# EAGLE design BCD Clock (EAGLE 4.16)
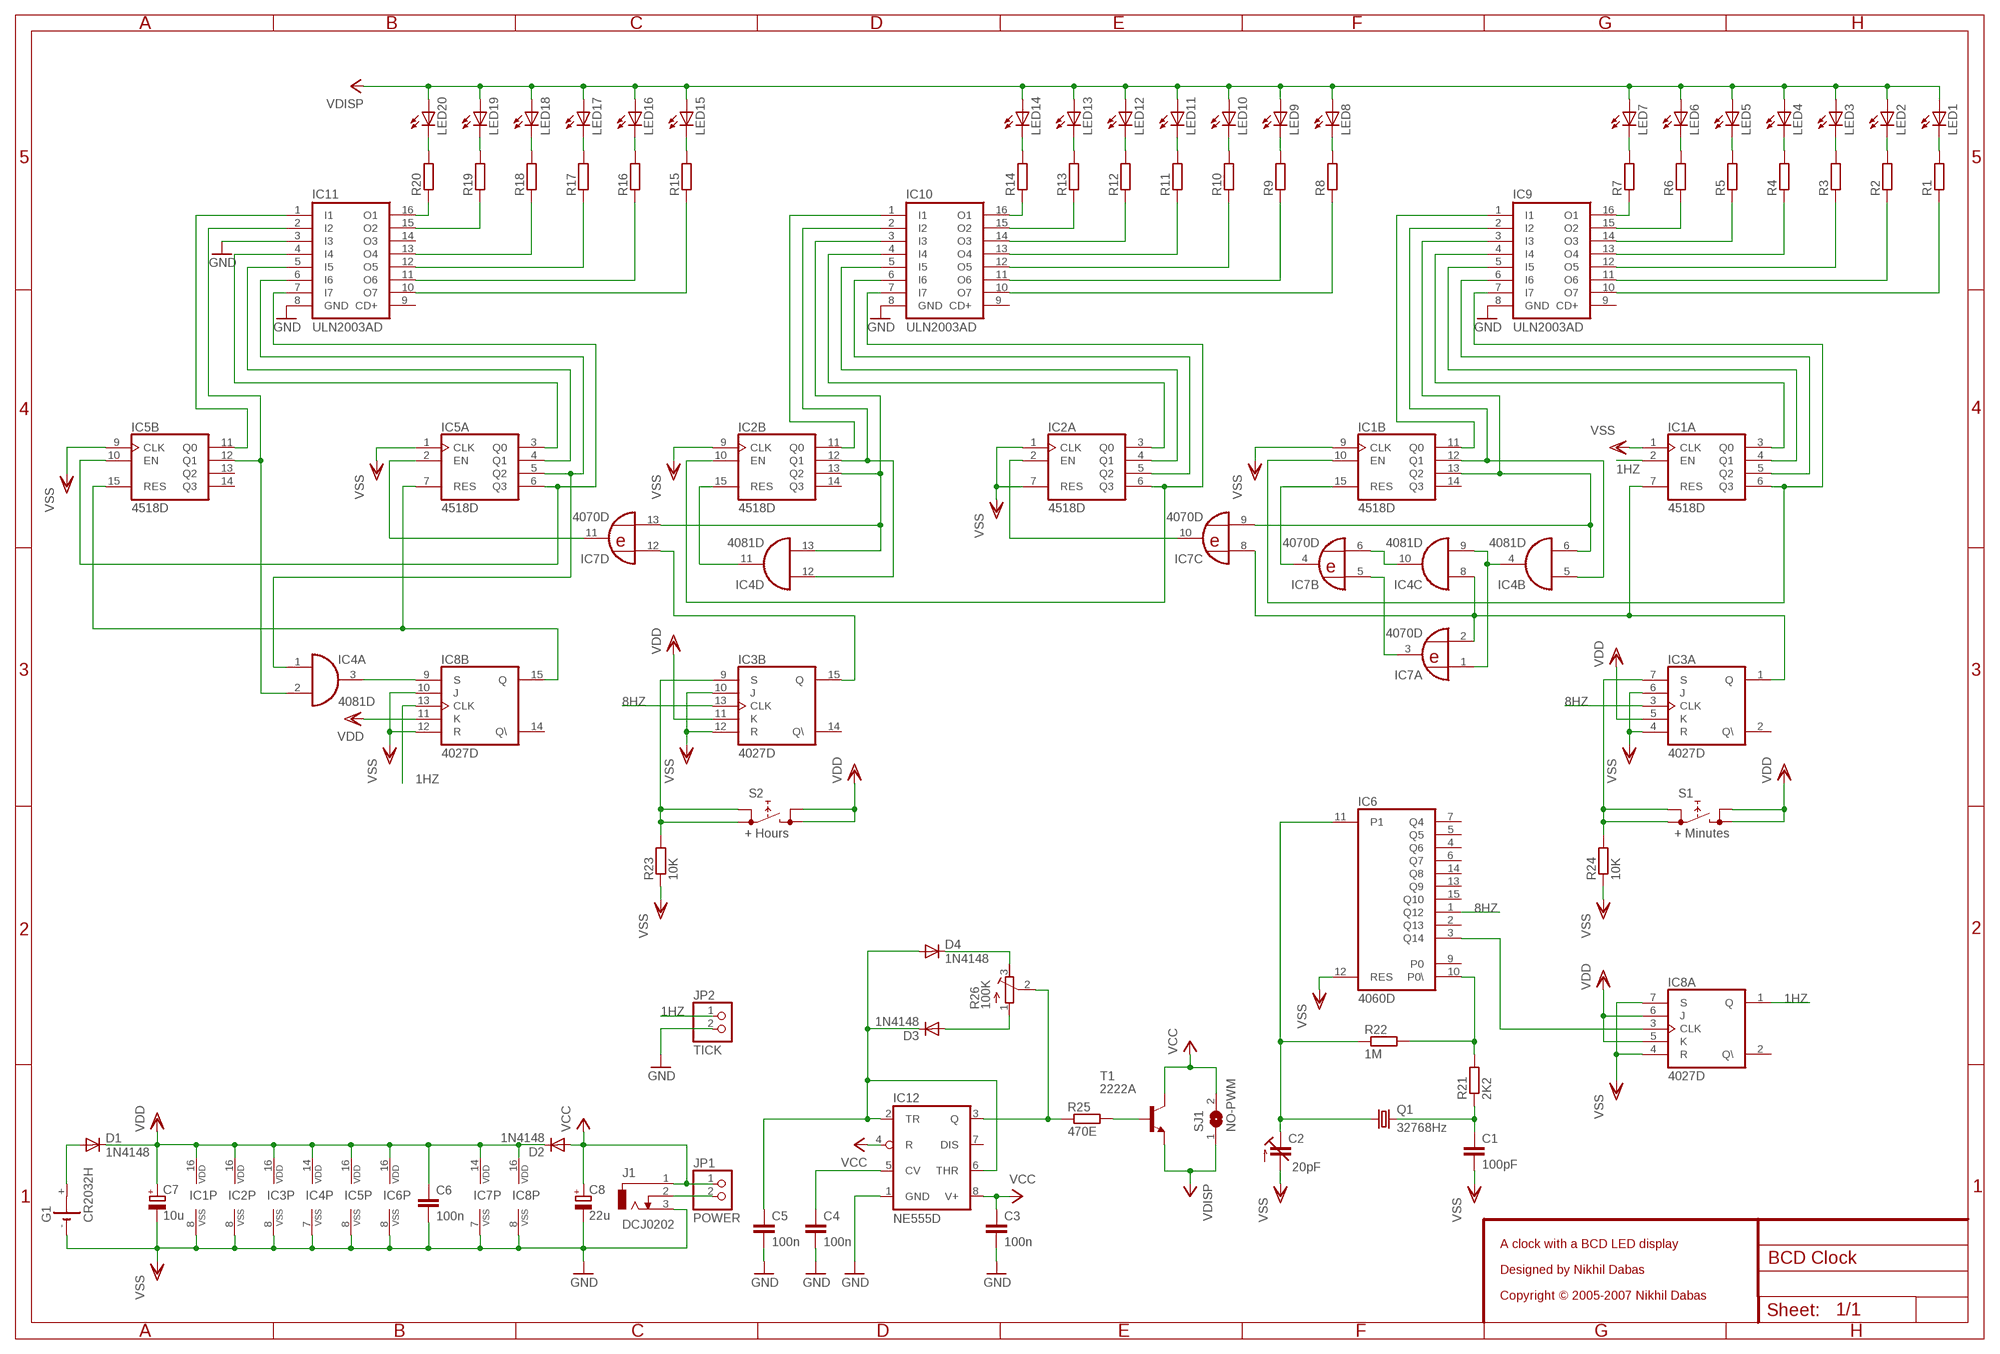
[diagram p0: schematic, sheet 1]

## Parts
C1  100pF  C-EUC1206  [C1206]
C2  20pF  C-TRIMMTZBX4  [CTRIMTZBX4]
C3  100n  C-EUC1206  [C1206]
C4  100n  C-EUC1206  [C1206]
C5  100n  C-EUC1206  [C1206]
C6  100n  C-EUC1206  [C1206]
C7  10u  CPOL-EUE2-5  [E2-5]
C8  22u  CPOL-EUE2-5  [E2-5]
D1  1N4148  DIODE-SOD80C  [SOD80C]
D2  1N4148  DIODE-SOD80C  [SOD80C]
D3  1N4148  DIODE-SOD80C  [SOD80C]
D4  1N4148  DIODE-SOD80C  [SOD80C]
G1  CR2032H  [CR2032H]
IC1  4518D  [SO16]
IC2  4518D  [SO16]
IC3  4027D  [SO16]
IC4  4081D  [SO14]
IC5  4518D  [SO16]
IC6  4060D  [SO16]
IC7  4070D  [SO14]
IC8  4027D  [SO16]
IC9  ULN2003AD  [SO16]
IC10  ULN2003AD  [SO16]
IC11  ULN2003AD  [SO16]
IC12  NE555D  [SO08]
J1  DCJ0202  [DCJ0202]
JP1  POWER  PINHD-1X2  [1X02]
JP2  TICK  PINHD-1X2  [1X02]
LED1  LEDCHIPLED_1206  [CHIPLED_1206]
LED2  LEDCHIPLED_1206  [CHIPLED_1206]
LED3  LEDCHIPLED_1206  [CHIPLED_1206]
LED4  LEDCHIPLED_1206  [CHIPLED_1206]
LED5  LEDCHIPLED_1206  [CHIPLED_1206]
LED6  LEDCHIPLED_1206  [CHIPLED_1206]
LED7  LEDCHIPLED_1206  [CHIPLED_1206]
LED8  LEDCHIPLED_1206  [CHIPLED_1206]
LED9  LEDCHIPLED_1206  [CHIPLED_1206]
LED10  LEDCHIPLED_1206  [CHIPLED_1206]
LED11  LEDCHIPLED_1206  [CHIPLED_1206]
LED12  LEDCHIPLED_1206  [CHIPLED_1206]
LED13  LEDCHIPLED_1206  [CHIPLED_1206]
LED14  LEDCHIPLED_1206  [CHIPLED_1206]
LED15  LEDCHIPLED_1206  [CHIPLED_1206]
LED16  LEDCHIPLED_1206  [CHIPLED_1206]
LED17  LEDCHIPLED_1206  [CHIPLED_1206]
LED18  LEDCHIPLED_1206  [CHIPLED_1206]
LED19  LEDCHIPLED_1206  [CHIPLED_1206]
LED20  LEDCHIPLED_1206  [CHIPLED_1206]
Q1  32768Hz  CRYTALTC26H  [TC26H]
R1  R-EU_R0805  [R0805]
R2  R-EU_R0805  [R0805]
R3  R-EU_R0805  [R0805]
R4  R-EU_R0805  [R0805]
R5  R-EU_R0805  [R0805]
R6  R-EU_R0805  [R0805]
R7  R-EU_R0805  [R0805]
R8  R-EU_R0805  [R0805]
R9  R-EU_R0805  [R0805]
R10  R-EU_R0805  [R0805]
R11  R-EU_R0805  [R0805]
R12  R-EU_R0805  [R0805]
R13  R-EU_R0805  [R0805]
R14  R-EU_R0805  [R0805]
R15  R-EU_R0805  [R0805]
R16  R-EU_R0805  [R0805]
R17  R-EU_R0805  [R0805]
R18  R-EU_R0805  [R0805]
R19  R-EU_R0805  [R0805]
R20  R-EU_R0805  [R0805]
R21  2K2  R-EU_R0805  [R0805]
R22  1M  R-EU_R0805  [R0805]
R23  10K  R-EU_R0805  [R0805]
R24  10K  R-EU_R0805  [R0805]
R25  470E  R-EU_R0805  [R0805]
R26  100K  R-TRIMM3103  [RTRIM3103]
S1  + Minutes  REKN  [REKN]
S2  + Hours  REKN  [REKN]
SJ1  NO-PWM  SJW  [SJW]
T1  2222A  MMBT2222ALT1-NPN-SOT23-BEC  [SOT23-BEC]

## Nets
1HZ: IC1.2(A:EN) IC8.1(A:Q) IC8.13(B:CLK) JP2.1
8HZ: IC3.3(A:CLK) IC3.13(B:CLK) IC6.1(Q12)
N$1: IC1.3(A:Q0) IC9.4(I4)
N$2: IC1.4(A:Q1) IC9.5(I5)
N$3: IC2.6(A:Q3) IC2.10(B:EN) IC10.7(I7)
N$4: IC1.6(A:Q3) IC1.10(B:EN) IC9.7(I7)
N$5: IC1.11(B:Q0) IC9.1(I1)
N$6: IC1.5(A:Q2) IC9.6(I6)
N$7: IC2.12(B:Q1) IC4.12(D:I0) IC10.2(I2)
N$8: IC2.5(A:Q2) IC10.6(I6)
N$9: IC3.7(A:S) R24.2 S1.0A S1.0B
N$10: IC5.2(A:EN) IC7.11(D:O)
N$11: IC2.4(A:Q1) IC10.5(I5)
N$12: IC2.3(A:Q0) IC10.4(I4)
N$13: IC1.12(B:Q1) IC4.5(B:I0) IC9.2(I2)
N$14: IC4.4(B:O) IC4.9(C:I1) IC7.1(A:I0)
N$15: IC2.11(B:Q0) IC10.1(I1)
N$16: IC5.4(A:Q1) IC11.5(I5)
N$17: IC5.3(A:Q0) IC11.4(I4)
N$18: LED11.C R11.2
N$19: IC11.10(O7) R15.1
N$20: IC11.11(O6) R16.1
N$21: IC11.12(O5) R17.1
N$22: IC11.13(O4) R18.1
N$23: IC11.16(O1) R20.1
N$24: IC11.15(O2) R19.1
N$25: IC10.16(O1) R14.1
N$26: IC10.15(O2) R13.1
N$27: IC10.13(O4) R11.1
N$28: IC10.14(O3) R12.1
N$29: IC10.12(O5) R10.1
N$30: IC10.11(O6) R9.1
N$31: IC1.7(A:RES) IC3.1(A:Q) IC4.8(C:I0) IC7.2(A:I1) IC7.8(C:I0)
N$32: IC1.15(B:RES) IC7.4(B:O)
N$33: IC4.10(C:O) IC7.6(B:I1)
N$34: IC7.3(A:O) IC7.5(B:I0)
N$35: IC2.15(B:RES) IC4.11(D:O)
N$36: IC3.9(B:S) R23.2 S2.0A S2.0B
N$38: IC10.10(O7) R8.1
N$39: LED20.C R20.2
N$40: IC5.11(B:Q0) IC11.1(I1)
N$41: IC5.6(A:Q3) IC5.10(B:EN) IC11.7(I7)
N$43: IC4.2(A:I1) IC5.12(B:Q1) IC11.2(I2)
N$44: LED19.C R19.2
N$45: IC4.3(A:O) IC8.9(B:S)
N$46: LED18.C R18.2
N$47: LED17.C R17.2
N$48: LED16.C R16.2
N$49: LED15.C R15.2
N$50: LED14.C R14.2
N$51: C1.1 Q1.2 R21.1
N$52: IC6.10(P0\) R21.2 R22.2
N$53: IC6.3(Q14) IC8.3(A:CLK)
N$54: C2.1(E) IC6.11(P1) Q1.1 R22.1
N$55: IC1.13(B:Q2) IC4.6(B:I1) IC7.9(C:I1) IC9.3(I3)
N$57: IC5.7(A:RES) IC5.15(B:RES) IC8.15(B:Q)
N$58 [Power]: J1.2 JP1.2
N$59: LED13.C R13.2
N$60: IC4.1(A:I0) IC5.5(A:Q2) IC11.6(I6)
N$62: LED12.C R12.2
N$63: LED10.C R10.2
N$64: LED9.C R9.2
N$65: LED8.C R8.2
N$66: IC9.16(O1) R7.1
N$67: IC9.15(O2) R6.1
N$68: IC9.14(O3) R5.1
N$69: IC9.13(O4) R4.1
N$70: IC9.12(O5) R3.1
N$71: IC9.11(O6) R2.1
N$72: IC9.10(O7) R1.1
N$73: LED7.C R7.2
N$74: LED6.C R6.2
N$75: LED5.C R5.2
N$76: LED4.C R4.2
N$77: LED3.C R3.2
N$78: LED2.C R2.2
N$79: LED1.C R1.2
N$80: D1.A G1.+
N$81: C4.1 IC12.5(CV)
N$82: C5.1 D3.C D4.A IC12.2(TR) IC12.6(THR)
N$83: IC12.3(Q) R25.1 R26.2(S)
N$84: R25.2 T1.B
N$85: D4.C R26.3(A)
N$86: D3.A R26.1(E)
N$87: IC2.2(A:EN) IC7.10(C:O)
N$88: IC2.13(B:Q2) IC4.13(D:I1) IC7.13(D:I1) IC10.3(I3)
N$89: IC3.15(B:Q) IC7.12(D:I0)
VCC [Power]: C3.1 C8.+ D2.A IC12.4(R) IC12.8(V+) J1.1 JP1.1 SJ1.2 T1.C
VDD [Power]: C6.1 C7.+ D1.C D2.C IC1.16(P:VDD) IC2.16(P:VDD) IC3.5(A:K) IC3.11(B:K) IC3.16(P:VDD) IC4.14(P:VDD) IC5.16(P:VDD) IC6.16(VDD) IC7.14(P:VDD) IC8.5(A:K) IC8.6(A:J) IC8.11(B:K) IC8.16(P:VDD) S1.1A S1.1B S2.1A S2.1B
VDISP [Power]: LED1.A LED2.A LED3.A LED4.A LED5.A LED6.A LED7.A LED8.A LED9.A LED10.A LED11.A LED12.A LED13.A LED14.A LED15.A LED16.A LED17.A LED18.A LED19.A LED20.A SJ1.1 T1.E
VSS [Power]: C1.2 C2.2(A) C3.2 C4.2 C5.2 C6.2 C7.- C8.- G1.- IC1.1(A:CLK) IC1.8(P:VSS) IC1.9(B:CLK) IC2.1(A:CLK) IC2.7(A:RES) IC2.8(P:VSS) IC2.9(B:CLK) IC3.4(A:R) IC3.6(A:J) IC3.8(P:VSS) IC3.10(B:J) IC3.12(B:R) IC4.7(P:VSS) IC5.1(A:CLK) IC5.8(P:VSS) IC5.9(B:CLK) IC6.8(VSS) IC6.12(RES) IC7.7(P:VSS) IC8.4(A:R) IC8.7(A:S) IC8.8(P:VSS) IC8.10(B:J) IC8.12(B:R) IC9.8(GND) IC10.8(GND) IC11.3(I3) IC11.8(GND) IC12.1(GND) J1.3 JP2.2 R23.1 R24.1 ; supply symbol labelled GND
Unconnected: G1.+@1(+) IC1.14(B:Q3) IC2.14(B:Q3) IC3.2(A:Q\) IC3.14(B:Q\) IC5.13(B:Q2) IC5.14(B:Q3) IC6.2(Q13) IC6.4(Q6) IC6.5(Q5) IC6.6(Q7) IC6.7(Q4) IC6.9(P0) IC6.13(Q9) IC6.14(Q8) IC6.15(Q10) IC8.2(A:Q\) IC8.14(B:Q\) IC9.9(CD+) IC10.9(CD+) IC11.9(CD+) IC11.14(O3) IC12.7(DIS)

## Notes on the sheet
- A clock with a BCD LED display
- Designed by Nikhil Dabas
- Copyright © 2005-2007 Nikhil Dabas

## Library data of the parts
C1 C3-C6 = rcl:C-EU: CAPACITOR, European symbol
C2 = rcl:C-TRIMM: Trimm capacitor
C7 C8 = rcl:CPOL-EU: POLARIZED CAPACITOR, European symbol
D1-D4 = diode:DIODE-: DIODE
G1 = battery:CR2032H: LI BATTERY Varta
IC1 IC2 IC5 = 45xx:4518: Dual BCD up COUNTER
IC3 IC8 = 40xx:4027: Dual JK FLIP FLOP
IC4 = 40xx:4081: Quad 2-input AND
IC6 = 40xx:4060: 14-stage binary/ripple COUNTER
IC7 = 40xx:4070: Quad 2-input XOR
IC9-IC11 = uln-udn:ULN2003A: DRIVER ARRAY
IC12 = linear:*555: TIMER
J1 = con-jack:DCJ0202: DC POWER JACK Source: DCJ0202.pdf
JP1 JP2 = pinhead:PINHD-1X2: PIN HEADER
LED1-LED20 = led:LED: LED OSRAM: - CHIPLED LG R971, LG N971, LY N971, LG Q971, LY Q971, LO R971, LY R971 LH N974, LH R974 LS Q976, LO Q976, LY Q976 LO Q996 - Hyper CHIPLED LW Q18S LB Q993, LB Q99A, LB R99A - SideLED LS A670, LO A670, LY A670, LG A670, LP A670 LB A673, LV A673, LT A673, LW A673 LH A674 LY A675 LS A676, LA A676, LO A676, LY A676, LW A676 LS A679, LY A679, LG A679 - Hyper Micro SIDELED® LS Y876, LA Y876, LO Y876, LY Y876 LT Y87S - SmartLED LW L88C, LW L88S LB L89C, LB L89S, LG L890 LS L89K, LO L89K, LY L89K LS L896, LA L896, LO L896, LY L896 - TOPLED LS T670, LO T670, LY T670, LG T670, LP T670 LSG T670, LSP T670, LSY T670, LOP T670, LYG T670 LG T671, LOG T671, LSG T671 LB T673, LV T673, LT T673, LW T673 LH T674 LS T676, LA T676, LO T676, LY T676, LB T676, LH T676, LSB T676, LW T676 LB T67C, LV T67C, LT T67C, LS T67K, LO T67K, LY T67K, LW E67C LS E67B, LA E67B, LO E67B, LY E67B, LB E67C, LV E67C, LT E67C LW T67C LS T679, LY T679, LG T679 LS T770, LO T770, LY T770, LG T770, LP T770 LB T773, LV T773, LT T773, LW T773 LH T774 LS E675, LA E675, LY E675, LS T675 LS T776, LA T776, LO T776, LY T776, LB T776 LHGB T686 LT T68C, LB T68C - Hyper Mini TOPLED® LB M676 - Mini TOPLED Santana® LG M470 LS M47K, LO M47K, LY M47K Source: http://www.osram.convergy.de/
Q1 = crystal:CRYTAL: CRYSTAL
R1-R25 = rcl:R-EU_: RESISTOR, European symbol
R26 = rcl:R-TRIMM: Trimm resistor
S1 S2 = switch:REKN: PUSH SWITCH ITT-Cannon-Cannon
SJ1 = jumper:SJ: SMD solder JUMPER
T1 = transistor:*-NPN-: NPN Transistror

## Net classes
0 default: width 0.305 mm, drill 0.203 mm
1 Power: width 0.61 mm, drill 0.406 mm

## Board
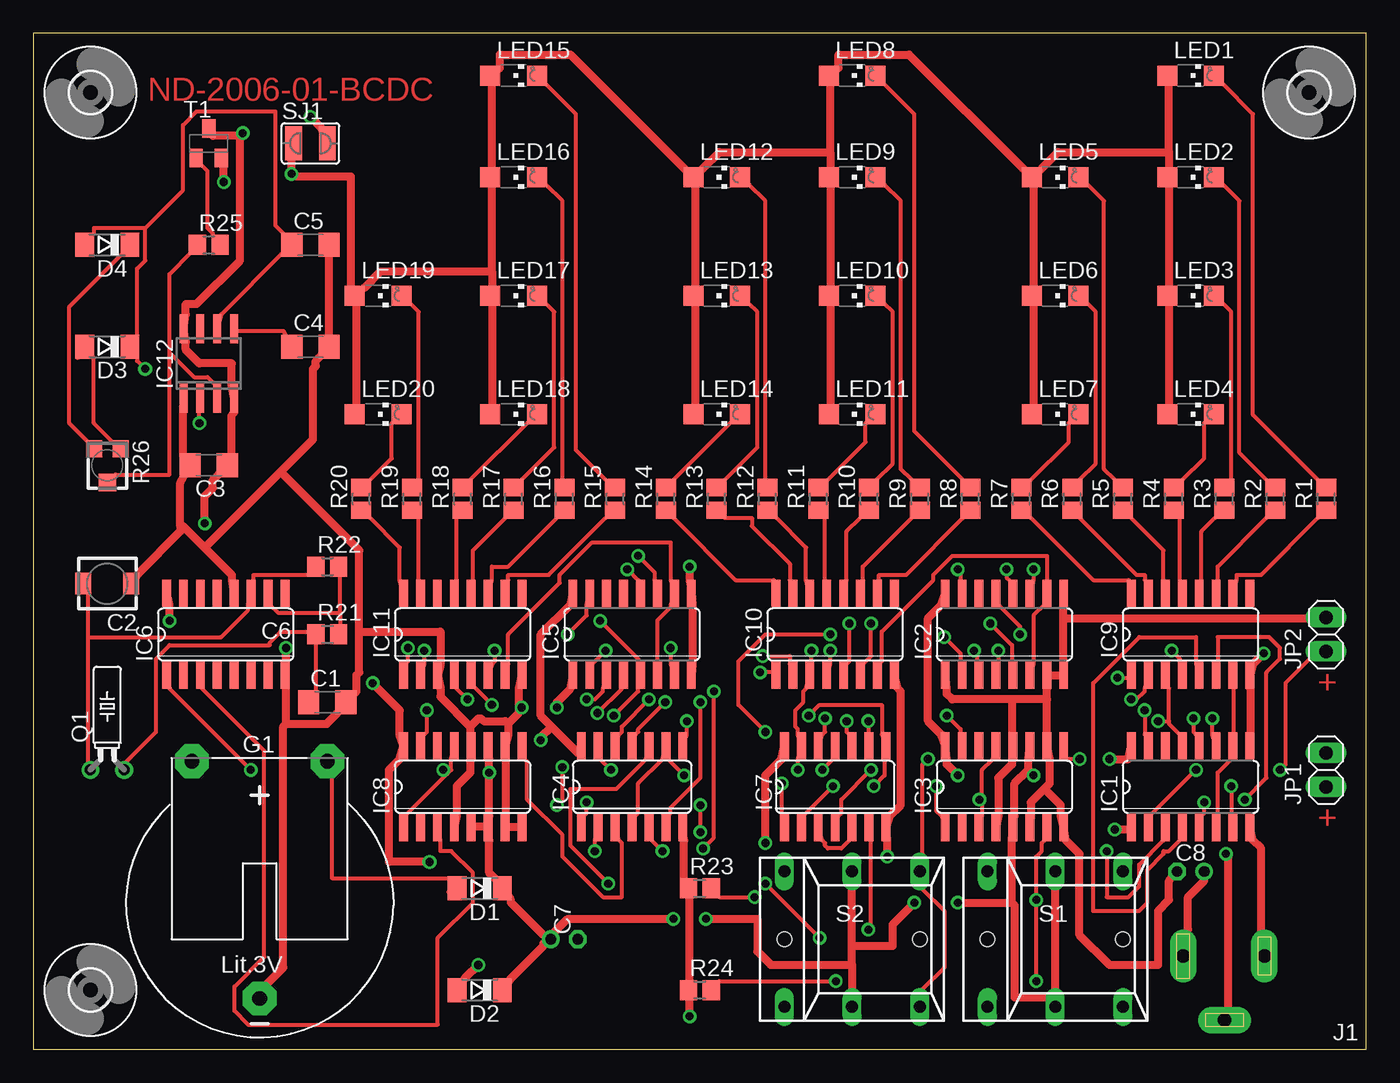
[diagram p1: board, top side]
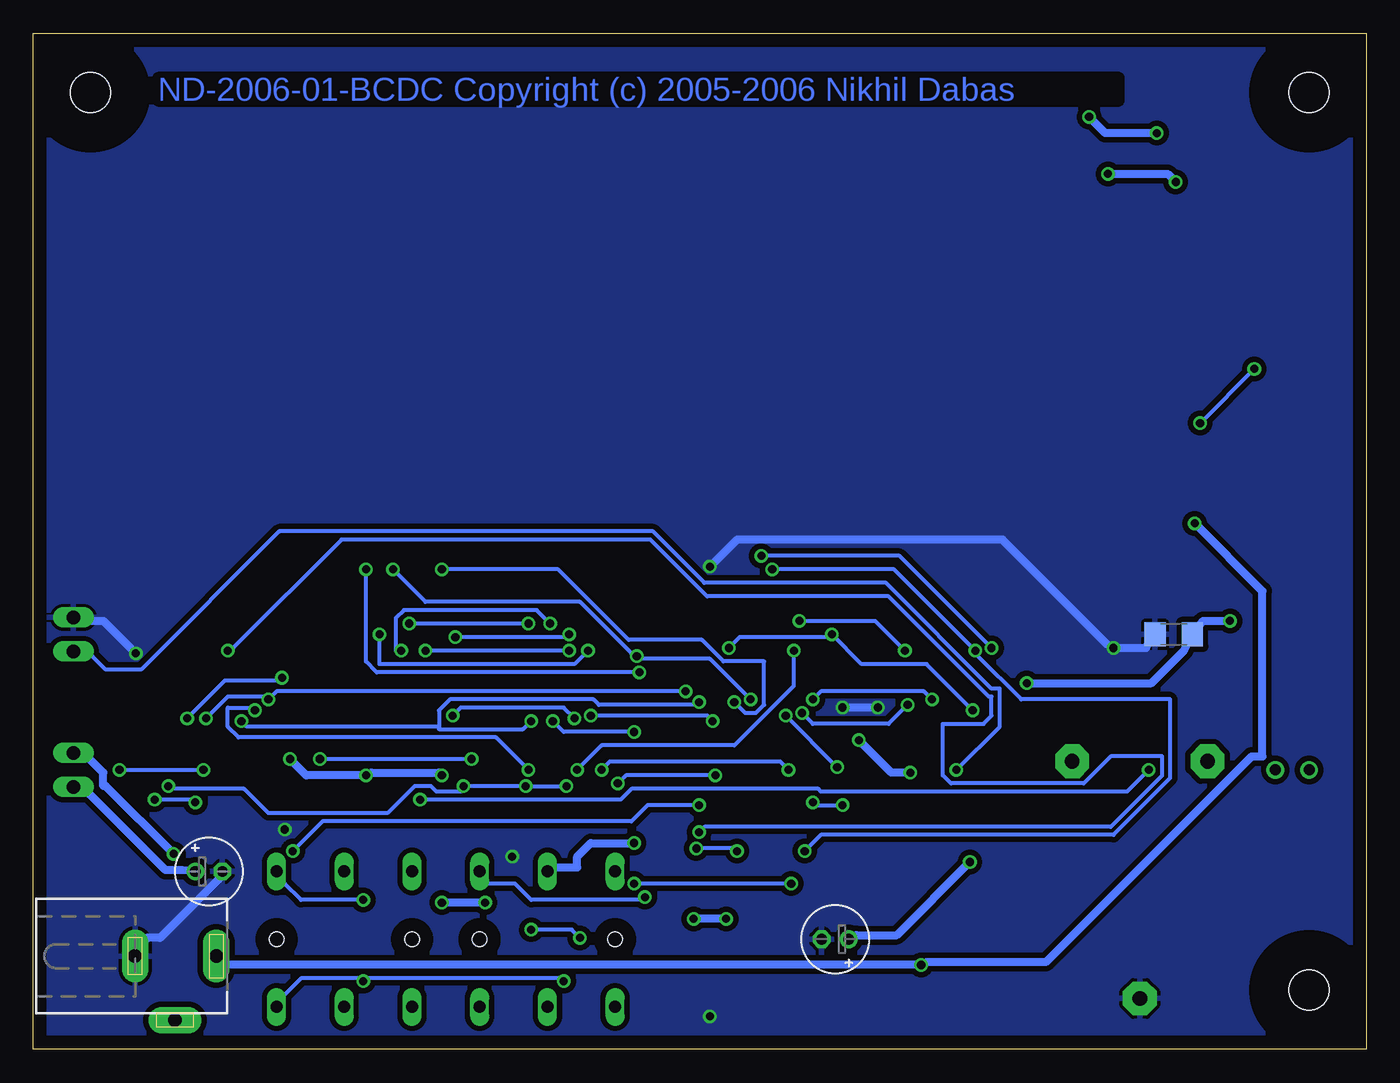
[diagram p2: board, bottom side, seen from below]

Size 100 x 76.19 mm. Coordinates in mm from the lower left corner, seen from the top.
Outline: 0,0 100,0 100,76.19 0,76.19 0,0
Copper layers (1*16): Top 0.035mm / dielectric 1.5mm / Bottom 0.035mm
Design rules "default": minimum track width 10mil, minimum drill 24mil, track to track 8mil, track to pad 8mil, pad to pad 8mil, via to via 8mil, smd to smd 8mil, copper to edge 40mil, drill to drill 8mil, minimum pad ring 10mil, minimum via ring 8mil, stop-mask expansion 4mil, vias tented up to drill 0mil, thermal gap 10mil

### Footprints (pad centres in the part's own frame; a part is rotated, then mirrored left to right if it is on the bottom)
C1206 = smd 1.6 x 1.8: 1 -1.4,0; 2 1.4,0
CTRIMTZBX4 = smd 1.6 x 1.2: 1 0,1.8; 2 0,-1.8
E2-5 = drill 0.813 pad 1.27 round: + -1.016,0 | drill 0.813 pad 1.27 octagon: - 1.016,0
SOD80C = smd 1.4 x 1.8: A 1.7,0; C -1.7,0
CR2032H = drill 1.118 pad 2.54 octagon: + 5.08,10.795; +@1 -5.08,10.795; - 0,-6.985
SO16 = smd 0.66 x 2.032: 1 -4.445,-3.073; 2 -3.175,-3.073; 3 -1.905,-3.073; 4 -0.635,-3.073; 5 0.635,-3.073; 6 1.905,-3.073; 7 3.175,-3.073; 8 4.445,-3.073; 9 4.445,3.073; 10 3.175,3.073; 11 1.905,3.073; 12 0.635,3.073; 13 -0.635,3.073; 14 -1.905,3.073; 15 -3.175,3.073; 16 -4.445,3.073
SO14 = smd 0.66 x 2.032: 1 -3.81,-3.073; 2 -2.54,-3.073; 3 -1.27,-3.073; 4 0,-3.073; 5 1.27,-3.073; 6 2.54,-3.073; 7 3.81,-3.073; 8 3.81,3.073; 9 2.54,3.073; 10 1.27,3.073; 11 0,3.073; 12 -1.27,3.073; 13 -2.54,3.073; 14 -3.81,3.073
SO08 = smd 0.6 x 2.2: 1 -1.905,-2.6; 2 -0.635,-2.6; 3 0.635,-2.6; 4 1.905,-2.6; 5 1.905,2.6; 6 0.635,2.6; 7 -0.635,2.6; 8 -1.905,2.6
DCJ0202 = drill 1 pad 2 long: 1 0,3.1; 2 4.8,0; 3 0,-3
1X02 = drill 1.016 long: 1 -1.27,0; 2 1.27,0
CHIPLED_1206 = smd 1.5 x 1.5: A 0,-1.75; C 0,1.75
TC26H = drill 0.813 round: 1 -1.27,0; 2 1.27,0
R0805 = smd 1.3 x 1.5: 1 -0.85,0; 2 0.85,0
RTRIM3103 = smd 1.2 x 1.25: 1 -1,-1.225; 3 1,-1.225 | smd 1.3 x 1.3: 2 0,1.3
REKN = drill 0.9 long: 0A 5.08,5.08; 0B 5.08,-5.08; 1A 0,5.08; 1B 0,-5.08; A -5.08,5.08; B -5.08,-5.08 | hole 1.1: -5.08,0; 5.08,0
SJW = smd 1.27 x 2.54: 1 -1.27,0; 2 1.27,0
SOT23-BEC = smd 1 x 1.4: B -0.95,-1.1; C 0,1.1; E 0.95,-1.1
3,0 = hole 3: 0,0

### Placement (x,y rotation side)
C1  22.06,26.03 0 top
C2  5.55,34.92 90 top
C3  13.17,43.81 180 top
C4  20.79,52.7 0 top
C5  20.79,60.32 0 top
C6  14.44,31.11 180 bottom
C7  39.84,8.25 180 bottom
C8  86.83,13.33 0 bottom
D1  33.49,12.06 180 top
D2  33.49,4.44 180 top
D3  5.55,52.7 180 top
D4  5.55,60.32 180 top
G1  16.98,10.79 0 top
IC1  86.83,19.68 0 top
IC2  72.86,31.11 0 top
IC3  72.86,19.68 0 top
IC4  44.92,19.68 0 top
IC5  44.92,31.11 0 top
IC6  14.44,31.11 0 top
IC7  60.16,19.68 0 top
IC8  32.22,19.68 0 top
IC9  86.83,31.11 0 top
IC10  60.16,31.11 0 top
IC11  32.22,31.11 0 top
IC12  13.17,51.43 0 top
J1  89.37,6.98 270 bottom
JP1  96.99,20.95 90 top
JP2  96.99,31.11 90 top
LED1  86.83,73.02 270 top
LED2  86.83,65.4 270 top
LED3  86.83,56.51 270 top
LED4  86.83,47.62 270 top
LED5  76.67,65.4 270 top
LED6  76.67,56.51 270 top
LED7  76.67,47.62 270 top
LED8  61.43,73.02 270 top
LED9  61.43,65.4 270 top
LED10  61.43,56.51 270 top
LED11  61.43,47.62 270 top
LED12  51.27,65.4 270 top
LED13  51.27,56.51 270 top
LED14  51.27,47.62 270 top
LED15  36.03,73.02 270 top
LED16  36.03,65.4 270 top
LED17  36.03,56.51 270 top
LED18  36.03,47.62 270 top
LED19  25.87,56.51 270 top
LED20  25.87,47.62 270 top
Q1  5.55,20.95 0 top
R1  96.99,41.27 90 top
R2  93.18,41.27 90 top
R3  89.37,41.27 90 top
R4  85.56,41.27 90 top
R5  81.75,41.27 90 top
R6  77.94,41.27 90 top
R7  74.13,41.27 90 top
R8  70.32,41.27 90 top
R9  66.51,41.27 90 top
R10  62.7,41.27 90 top
R11  58.89,41.27 90 top
R12  55.08,41.27 90 top
R13  51.27,41.27 90 top
R14  47.46,41.27 90 top
R15  43.65,41.27 90 top
R16  39.84,41.27 90 top
R17  36.03,41.27 90 top
R18  32.22,41.27 90 top
R19  28.41,41.27 90 top
R20  24.6,41.27 90 top
R21  22.06,31.11 0 top
R22  22.06,36.19 0 top
R23  50,12.06 0 top
R24  50,4.44 0 top
R25  13.17,60.32 0 top
R26  5.55,43.81 180 top
S1  76.67,8.25 0 top
S2  61.43,8.25 0 top
SJ1  20.79,67.94 0 top
T1  13.17,67.94 0 top
U$1  [3,0]  4.28,71.75 0 top
U$3  [3,0]  95.72,71.75 0 top
U$4  [3,0]  4.28,4.44 0 top

### Tracks (layer width: path | path; a pad name or v marks a point on that pad's centre or on a via)
1HZ  (via drill 0.61)
  Top 0.305: v87.24,20.95 83.78,17.5 IC1.2 | v93.54,20.95 93.94,21.36 93.94,27.45 95.77,29.28 JP2.1 | 31.05,20.65 31.36,20.95 31.36,21.76 IC8.13 | 31.05,20.65 27.9,17.5 IC8.1 | 31.05,20.65 v30.75,20.95
  Bottom 0.305: v93.54,20.95 v87.24,20.95 | v30.75,20.95 27.5,24.2 27.5,27.05 28.11,27.05 36.03,34.97 49.64,34.97 53.51,38.83 81.55,38.83 91.91,28.47 94.55,28.47 95.57,29.48 JP2.1
8HZ  (via drill 0.61)
  Top 0.305: 71.18,18.71 71.18,20.95 72,21.76 IC3.13 | 71.18,18.71 71.18,17.5 IC3.3 | v16.32,20.95 10.22,27.05 IC6.1 | v70.98,18.71 71.18,18.71
  Bottom 0.305: v16.32,20.95 17.95,19.32 40.91,19.32 41.11,19.53 55.13,19.53 55.94,18.71 v70.98,18.71
N$1  (via drill 0.61)
  Top 0.305: v80.53,14.85 80.53,11.4 82.16,11.4 82.97,12.21 82.97,13.84 84.8,15.67 IC1.3 | v50.05,16.28 v50.05,18.31 | v85.41,29.89 86.02,29.28 86.02,28.87 IC9.4
  Bottom 0.305: v80.53,14.85 78.3,17.09 55.13,17.09 53.91,18.31 v50.05,18.31 | v50.05,16.28 49.64,16.68 19.16,16.68 15.3,20.54 15.3,21.97 19.16,21.97 21.2,19.93 31.15,19.93 31.76,20.54 31.76,24.4 28.71,24.4 28.11,25.01 28.11,26.44 28.31,26.44 35.83,33.95 49.44,33.95 53.71,38.22 76.87,38.22 85,30.09 v85.41,29.89
N$2
  Top 0.305: IC1.4 86.02,15.67 85.2,14.85 84.8,14.85 84.8,14.65 83.58,13.43 83.58,10.99 82.97,10.38 79.51,10.38 79.51,27.45 82.97,30.91 87.24,30.91 87.24,28.87 IC9.5
N$3
  Top 0.305: IC10.7 63.46,28.87 63.67,29.08 63.67,31.31 67.53,35.17 67.53,35.58 68.95,37 76.06,37 76.06,35.17 IC2.10 75.86,33.35 75.04,32.53 75.04,28.87 IC2.6
N$4
  Top 0.305: IC1.6 88.86,17.5 88.86,20.75 89.88,21.76 IC1.10 90.08,23.59 90.08,27.05 IC9.7
N$5  (via drill 0.61)
  Top 0.305: v81.34,27.86 82.16,27.86 IC9.1 | v88.46,24.81 88.46,23.59 IC1.11
  Bottom 0.305: v81.34,27.86 81.55,27.66 85.61,27.66 v88.46,24.81
N$6  (via drill 0.61)
  Top 0.305: v87.85,18.51 87.85,17.7 87.64,17.5 IC1.5 | v90.89,18.71 92.52,20.34 92.52,28.27 93.54,29.28 93.54,30.09 92.72,30.91 88.86,30.91 88.86,28.87 IC9.6
  Bottom 0.305: v87.85,18.51 88.05,18.71 v90.89,18.71
N$7  (via drill 0.61)
  Top 0.305: v46.19,26.23 44.16,24.2 44.16,23.79 43.95,23.59 IC4.12 | v54.72,29.48 56.76,29.48 56.76,28.87 IC10.2 | v73.01,35.99 73.01,35.38 73.22,35.17 IC2.12
  Bottom 0.305: v46.19,26.23 49.24,29.28 54.52,29.28 v54.72,29.48 55.13,29.69 58.99,33.55 70.57,33.55 v73.01,35.99
N$8  (via drill 0.61)
  Top 0.305: v62.85,31.92 62.85,29.48 62.24,28.87 IC10.6 | v71.79,31.92 73.42,30.3 73.42,28.87 IC2.5
  Bottom 0.305: v62.85,31.92 v71.79,31.92
N$9  (via drill 0.61)
  Top 0.305: v60.21,5.1 51.47,5.1 R24.2 | v75.25,5.1 v75.25,11.2 75.25,14.45 75.65,14.85 75.65,15.46 75.86,15.67 IC3.7
  Bottom 0.305: v60.21,5.1 60.41,5.3 75.25,5.3 | 75.25,5.3 79.92,5.3 81.14,4.08 S1.0B | 75.25,5.3 v75.25,5.1 | v75.25,11.2 79.92,11.2 81.14,12.42 S1.0A
N$10  (via drill 0.61)
  Top 0.305: v59.19,20.95 60.01,21.76 IC7.11 | v42.94,29.89 41.92,28.87 IC5.2
  Bottom 0.305: v59.19,20.95 57.37,22.78 47.41,22.78 42.94,27.25 v42.94,29.89
N$11  (via drill 0.61)
  Top 0.305: v61.23,31.92 61.23,29.08 61.02,28.87 IC10.5 | v72.4,29.89 72.4,28.87 IC2.4
  Bottom 0.305: v61.23,31.92 62.24,32.94 72.2,32.94 72.81,32.33 72.81,29.89 v72.4,29.89
N$12  (via drill 0.61)
  Top 0.305: v59.8,29.89 59.8,28.87 IC10.4 | v70.57,29.89 70.78,29.69 70.78,28.87 IC2.3
  Bottom 0.305: v59.8,29.89 v70.57,29.89
N$13  (via drill 0.61)
  Top 0.305: v47.21,14.85 46.39,15.67 IC4.5 | v50.25,15.06 51.07,15.87 v51.07,26.84 | v82.36,26.23 82.77,26.23 83.38,26.84 83.38,27.05 IC9.2 | v87.03,24.81 87.03,23.79 87.24,23.59 IC1.12
  Bottom 0.305: v47.21,14.85 47.41,15.06 v50.25,15.06 | v51.07,26.84 81.75,26.84 v82.36,26.23 82.77,26.44 85.41,26.44 v87.03,24.81
N$14  (via drill 0.61)
  Top 0.305: IC4.4 45.17,17.5 45.38,17.7 45.38,19.93 47.21,21.76 IC4.9 47.61,21.76 v48.83,20.54 | v56.15,19.93 56.15,17.5 IC7.1
  Bottom 0.305: v56.15,19.93 55.54,20.54 v48.83,20.54
N$15  (via drill 0.61)
  Top 0.305: v54.52,28.27 55.54,28.27 IC10.1 | v75.04,35.99 75.04,35.17 IC2.11
  Bottom 0.305: v54.52,28.27 74.23,28.27 75.04,29.08 v75.04,35.99
N$16  (via drill 0.61)
  Top 0.305: v34.4,25.83 32.98,27.25 IC11.5 | v42.33,25.22 44.16,27.05 IC5.4
  Bottom 0.305: v34.4,25.83 35.83,24.4 41.52,24.4 v42.33,25.22
N$17  (via drill 0.61)
  Top 0.305: v32.58,26.23 31.76,27.05 IC11.4 | v41.52,26.23 42.13,26.23 42.74,26.84 42.74,27.05 IC5.3
  Bottom 0.305: v32.58,26.23 33.19,26.84 40.91,26.84 v41.52,26.23
N$18
  Top 0.305: R11.2 59.6,42.69 62.45,45.54 62.45,46.96 LED11.C
N$19
  Top 0.305: R15.1 42.94,39.85 38.67,35.58 35.62,35.58 35.62,35.17 IC11.10
N$20
  Top 0.305: R16.1 39.28,39.85 35.62,36.19 34.4,36.19 34.4,35.17 IC11.11
N$21
  Top 0.305: R17.1 35.42,39.85 32.98,37.41 32.98,35.17 IC11.12
N$22
  Top 0.305: R18.1 31.76,39.85 31.76,35.17 IC11.13
N$23
  Top 0.305: R20.1 25.26,39.85 27.5,37.61 27.5,35.17 IC11.16
N$24
  Top 0.305: R19.1 28.92,39.85 28.92,35.17 IC11.15
N$25
  Top 0.305: R14.1 48.02,39.85 52.69,35.17 55.54,35.17 IC10.16
N$26
  Top 0.305: R13.1 51.88,39.85 53.91,39.85 53.91,39.24 56.76,36.39 56.76,35.17 IC10.15
N$27
  Top 0.305: R11.1 59.4,39.85 59.4,35.17 IC10.13
N$28
  Top 0.305: R12.1 55.74,39.85 57.98,37.61 57.98,35.17 IC10.14
N$29
  Top 0.305: R10.1 62.04,39.85 61.02,38.83 61.02,35.17 IC10.12
N$30
  Top 0.305: R9.1 65.9,39.85 62.24,36.19 62.24,35.17 IC10.11
N$31  (via drill 0.61)
  Top 0.305: v60.01,19.73 57.77,17.5 IC7.2 | v63.06,19.73 63.87,20.54 63.87,21.76 IC7.8 63.67,23.59 63.67,25.83 58.99,25.83 v58.18,25.01 | v67.73,19.73 67.73,17.9 68.14,17.5 IC3.1 | v49.03,24.61 49.03,23.59 IC4.8 | v89.88,19.73 89.88,17.5 IC1.7
  Bottom 0.305: v60.01,19.73 v63.06,19.73 v67.73,19.73 67.93,19.32 69.76,19.32 70.17,19.73 71.39,19.73 73.42,17.7 82.36,17.7 84.19,19.53 89.67,19.53 v89.88,19.73 | v49.03,24.61 49.44,25.01 v58.18,25.01
N$32  (via drill 0.61)
  Top 0.305: v62.85,20.95 60.62,18.71 60.62,17.7 60.41,17.5 IC7.4 | v83.38,25.42 83.38,23.59 IC1.15
  Bottom 0.305: v62.85,20.95 65.29,23.39 84.59,23.39 85.41,24.2 85.41,25.62 83.58,25.62 v83.38,25.42
N$33  (via drill 0.61)
  Top 0.305: v43.14,12.42 40.3,15.26 40.3,19.53 43.75,19.53 45.99,21.76 IC4.10 | v54.93,12.42 v58.99,8.35 | v62.65,8.96 62.85,9.16 62.85,15.67 IC7.6
  Bottom 0.305: v43.14,12.42 v54.93,12.42 | v58.99,8.35 59.6,8.96 v62.65,8.96
N$34
  Top 0.305: IC7.3 59.19,15.67 59.4,15.46 59.4,15.26 59.6,15.06 60.62,15.06 61.23,15.67 IC7.5
N$35  (via drill 0.61)
  Top 0.305: v47.41,26.03 45.38,24 45.38,23.79 45.17,23.59 IC4.11 | v69.35,35.99 69.56,35.78 69.56,35.17 IC2.15
  Bottom 0.305: v47.41,26.03 46.6,25.22 45.78,25.22 45.17,25.83 45.17,29.08 48.22,29.08 49.85,30.7 55.33,30.7 60.62,35.99 v69.35,35.99
N$36  (via drill 0.61)
  Top 0.305: v54.11,11.4 51.47,11.4 R23.2 | v78.5,21.76 77.48,21.76 IC3.9 | v67.12,21.76 66.71,21.36 66.71,14.65 S2.0A 66.71,12.01 68.34,10.38 68.34,6.12 66.71,4.49 S2.0B
  Bottom 0.305: v54.11,11.4 54.32,11.2 62.65,11.2 63.87,12.42 65.9,12.42 S2.0A | v67.12,21.76 v78.5,21.76
N$38
  Top 0.305: R8.1 69.76,39.85 65.49,35.58 63.46,35.58 63.46,35.17 IC10.10
N$39
  Top 0.305: R20.2 25.26,42.69 26.89,44.32 26.89,46.96 LED20.C
N$40  (via drill 0.61)
  Top 0.305: v28.11,30.09 28.11,29.08 27.9,28.87 IC11.1 | v45.38,37 46.6,35.78 46.6,35.17 IC5.11
  Bottom 0.305: v28.11,30.09 35.01,37 v45.38,37
N$41
  Top 0.305: IC11.7 35.62,28.87 35.62,31.11 39.48,34.97 39.48,35.58 41.92,38.02 47.82,38.02 47.82,35.17 IC5.10 47.82,33.35 47.82,33.14 46.8,32.13 46.8,28.87 IC5.6
N$43  (via drill 0.61)
  Top 0.305: v29.32,29.89 29.32,28.87 IC11.2 | v44.56,35.99 45.38,35.17 IC5.12 | v42.13,14.85 42.13,15.67 IC4.2
  Bottom 0.305: v44.56,35.99 35.42,35.99 v29.32,29.89 29.12,29.48 25.87,26.23 14.69,26.23 14.69,20.34 18.96,16.07 40.91,16.07 v42.13,14.85
N$44
  Top 0.305: R19.2 28.92,42.69 28.92,55.29 28.31,55.9 LED19.C
N$45
  Top 0.305: IC8.9 36.84,21.76 37.05,21.56 37.05,18.71 39.69,16.07 39.69,14.45 42.74,11.4 44.16,11.4 44.16,15.46 43.95,15.67 IC4.3
N$46
  Top 0.305: R18.2 32.78,42.69 37.05,46.96 LED18.C
N$47
  Top 0.305: R17.2 36.64,42.69 39.08,45.13 39.08,55.29 38.47,55.9 LED17.C
N$48
  Top 0.305: R16.2 39.69,42.69 39.69,63.62 38.47,64.84 LED16.C
N$49
  Top 0.305: R15.2 42.94,42.69 40.7,44.93 40.7,70.12 38.47,72.36 LED15.C
N$50
  Top 0.305: R14.2 48.02,42.69 52.29,46.96 LED14.C
N$51
  Top 0.305: C1.1 21.2,26.84 21.2,30.5 R21.1 20.59,31.31 18.55,31.31 17.74,30.5 17.74,30.3 10.22,30.3 9.21,29.28 9.21,23.79 6.97,21.56 Q1.2
N$52
  Top 0.305: 23.03,32.74 23.03,35.58 R22.2 | 23.03,32.74 23.03,31.72 R21.2 | 23.03,32.74 18.35,32.74 17.74,33.35 IC6.10
N$53
  Top 0.305: IC6.3 12.66,27.05 17.34,22.37 17.34,6.93 15.1,4.69 15.1,2.87 16.12,1.85 30.34,1.85 30.34,8.35 32.98,10.99 32.98,13.23 31.36,14.85 30.54,14.85 30.54,15.67 IC8.3
N$54
  Top 0.305: R22.1 20.59,35.58 16.52,35.58 16.52,35.17 IC6.11 16.12,33.35 16.12,32.94 14.08,30.91 4.13,30.91 | 4.13,30.91 4.13,21.56 Q1.1 | 4.13,30.91 4.13,34.16 C2.1
N$55  (via drill 0.61)
  Top 0.305: 85.2,24.61 85.2,27.05 IC9.3 | 85.2,24.61 85.2,24.4 86.02,23.59 IC1.13 | v50.05,26.03 50.05,20.34 47.82,18.11 47.82,17.7 47.61,17.5 IC4.6 | v62.65,24.61 62.65,23.59 IC7.9 | v84.39,24.61 85.2,24.61
  Bottom 0.305: v50.05,26.03 50.25,25.83 57.57,25.83 57.98,26.23 68.75,26.23 69.56,25.42 69.56,24.2 | 69.56,24.2 69.56,24 63.26,24 v62.65,24.61 | v84.39,24.61 83.99,24.2 69.56,24.2
N$57  (via drill 0.61)
  Top 0.305: v29.53,25.42 29.53,23.79 29.32,23.59 IC8.15 | v40.09,31.11 41.52,32.53 41.52,33.35 IC5.15 | v47.82,30.09 47.82,28.87 IC5.7
  Bottom 0.305: v29.53,25.42 32.98,28.87 37.86,28.87 v40.09,31.11 40.5,30.91 47,30.91 v47.82,30.09
N$58  (via drill 0.61)
  Top 0.61: v89.47,14.65 89.67,14.45 89.67,3.07 J1.2
  Bottom 0.61: v89.47,14.65 94.55,19.73 94.75,19.73 94.75,20.75 95.77,21.76 JP1.2
N$59
  Top 0.305: R13.2 51.88,42.69 54.32,45.13 54.32,55.29 53.71,55.9 LED13.C
N$60  (via drill 0.61)
  Top 0.305: v41.52,18.51 41.52,17.7 41.31,17.5 IC4.1 | v39.28,18.31 39.69,18.71 v39.69,21.15 | v43.55,25.01 45.38,26.84 45.38,27.05 IC5.5 45.38,28.87 45.38,29.28 v42.53,32.13 | v34.61,29.89 34.61,29.08 34.4,28.87 IC11.6
  Bottom 0.305: v41.52,18.51 41.31,18.31 v39.28,18.31 | v39.69,21.15 v43.55,25.01 | v34.61,29.89 36.84,32.13 v42.53,32.13
N$62
  Top 0.305: R12.2 54.93,42.69 54.93,63.62 53.71,64.84 LED12.C
N$63
  Top 0.305: R10.2 63.26,42.69 64.48,43.91 64.48,55.29 63.87,55.9 LED10.C
N$64
  Top 0.305: R9.2 65.9,42.69 65.09,43.51 65.09,63.62 63.87,64.84 LED9.C
N$65
  Top 0.305: R8.2 69.76,42.69 66.1,46.35 66.1,70.12 63.87,72.36 LED8.C
N$66
  Top 0.305: R7.1 74.84,39.85 79.51,35.17 82.16,35.17 IC9.16
N$67
  Top 0.305: R6.1 78.5,39.85 82.77,35.58 83.38,35.58 83.38,35.17 IC9.15
N$68
  Top 0.305: R5.1 82.36,39.85 84.8,37.41 84.8,35.17 IC9.14
N$69
  Top 0.305: R4.1 86.02,39.85 86.02,35.17 IC9.13
N$70
  Top 0.305: R3.1 88.66,39.85 87.64,38.83 87.64,35.17 IC9.12
N$71
  Top 0.305: R2.1 92.52,39.85 88.86,36.19 88.86,35.17 IC9.11
N$72
  Top 0.305: R1.1 96.38,39.85 92.11,35.58 90.28,35.58 90.28,35.17 IC9.10
N$73
  Top 0.305: R7.2 74.84,42.69 77.69,45.54 77.69,46.96 LED7.C
N$74
  Top 0.305: R6.2 78.5,42.69 79.72,43.91 79.72,55.29 79.11,55.9 LED6.C
N$75
  Top 0.305: R5.2 81.14,42.69 80.33,43.51 80.33,63.62 79.11,64.84 LED5.C
N$76
  Top 0.305: R4.2 86.22,42.69 87.85,44.32 87.85,46.96 LED4.C
N$77
  Top 0.305: R3.2 89.88,42.69 89.88,55.29 89.27,55.9 LED3.C
N$78
  Top 0.305: R2.2 92.52,42.69 90.49,44.72 90.49,63.62 89.27,64.84 LED2.C
N$79
  Top 0.305: R1.2 96.38,42.69 91.5,47.57 91.5,70.12 89.27,72.36 LED1.C
N$80
  Top 0.305: 31.15,11.81 D1.A 31.15,12.82 22.42,12.82 22.42,20.34 G1.+
N$81
  Top 0.305: IC12.5 15.3,53.87 18.76,53.87 C4.1
N$82  (via drill 0.61)
  Top 0.305: 8.39,61.59 8.39,59.15 7.79,58.54 7.79,53.46 D3.C 7.79,51.84 7.79,51.63 v8.39,51.02 | 8.39,61.59 4.53,61.59 4.53,61.18 D4.A | 8.39,61.59 11.24,64.43 11.24,69.31 12.26,70.33 18.15,70.33 18.15,61.79 18.76,61.18 C5.1 18.76,59.76 14.08,55.09 IC12.6 | v12.46,46.96 12.46,47.77 IC12.2
  Bottom 0.305: v8.39,51.02 v12.46,46.96
N$83
  Top 0.305: 10.22,52.24 10.22,58.14 11.85,59.76 R25.1 | 10.22,52.24 10.22,43.1 6.16,43.1 R26.2 | 10.22,52.24 12.05,50.41 13.07,50.41 13.68,49.8 IC12.3
N$84
  Top 0.305: T1.B 12.66,66.26 13.07,65.86 13.07,61.59 13.47,61.18 13.47,60.98 R25.2
N$85
  Top 0.305: R26.3 4.13,45.54 2.71,46.96 2.71,55.7 6.57,59.56 D4.C
N$86
  Top 0.305: 3.31,51.84 D3.A 4.53,51.84 4.53,46.96 5.96,45.54 R26.1
N$87  (via drill 0.61)
  Top 0.305: v61.02,24.61 61.02,23.79 61.23,23.59 IC7.10 | v54.93,23.79 52.9,25.83 52.9,29.08 54.93,31.11 v59.8,31.11 | v68.34,30.91 69.56,29.69 69.56,28.87 IC2.2
  Bottom 0.305: v61.02,24.61 60.21,23.79 v54.93,23.79 | v59.8,31.11 60.01,30.91 v68.34,30.91
N$88  (via drill 0.61)
  Top 0.305: v43.35,20.95 42.53,21.76 IC4.13 | v57.37,20.95 57.37,21.76 IC7.13 57.37,23.59 57.37,24 57.16,24.2 57.16,25.42 57.77,26.03 57.77,26.84 57.98,27.05 IC10.3 58.38,28.87 v58.38,29.89 | v74.03,31.11 74.03,31.72 72.4,33.35 IC2.13
  Bottom 0.305: v43.35,20.95 43.95,21.56 56.76,21.56 v57.37,20.95 | v74.03,31.11 74.03,28.87 59.4,28.87 v58.38,29.89
N$89  (via drill 0.61)
  Top 0.305: v59.4,24.81 59.4,23.79 59.19,23.59 IC7.12 | v68.54,25.01 69.56,24 69.56,23.59 IC3.15
  Bottom 0.305: v59.4,24.81 60.21,25.62 67.93,25.62 v68.54,25.01
VCC  (via drill 0.61)
  Top 0.61: T1.C 13.47,68.5 15.51,68.5 v15.71,68.7 15.51,68.3 15.51,59.15 12.26,55.9 11.44,55.9 11.44,55.09 IC12.8 11.44,53.06 11.44,52.45 12.46,51.43 14.9,51.43 14.9,49.8 IC12.4 15.1,47.77 14.9,47.57 14.9,44.52 C3.1 13.88,43.1 13.47,42.69 13.47,42.08 12.87,41.47 v12.87,39.44 | v20.79,69.92 21.6,69.11 SJ1.2 | C8.+ 87.85,12.62 86.63,11.4 86.63,8.96 J1.1 | v33.39,6.32 32.37,5.3 D2.A
  Bottom 0.61: v20.79,69.92 19.57,68.7 v15.71,68.7 | JP1.1 95.77,19.12 90.08,13.43 88.86,13.43 C8.+ | J1.1 85.41,6.32 v33.39,6.32 32.98,6.52 24.04,6.52 8.6,21.97 7.79,21.97 7.79,34.36 v12.87,39.44
VDD  (via drill 0.61)
  Top 0.61: IC2.16 68.14,33.35 67.12,32.33 67.12,24.61 68.14,23.59 IC3.16 68.54,21.76 68.54,21.36 v69.35,20.54 | 74.64,20.95 73.62,19.93 73.62,17.5 IC3.5 73.42,15.67 73.42,10.99 | 74.64,20.95 74.64,21.76 IC3.11 | v80.73,21.76 82.16,21.76 IC1.16 | 74.64,20.95 v75.04,20.54 | 61.43,6.32 S2.1B | 61.43,6.32 61.43,7.74 | 38.87,24.2 40.91,22.17 IC4.14 | 38.87,24.2 38.06,25.01 38.06,31.11 40.3,33.35 IC5.16 | D2.C 35.83,5.3 38.27,7.74 38.27,7.95 C7.+ | v10.22,32.13 10.22,33.35 IC6.16 | IC8.6 34.2,15.67 34.2,13.23 34.61,12.82 D1.C 35.83,11.2 35.83,10.99 38.27,8.55 C7.+ | IC8.5 32.98,16.68 34,16.68 IC8.6 | IC8.11 34.2,21.76 v34.2,20.75 34.2,17.5 IC8.6 | v25.46,27.45 27.5,25.42 27.5,23.59 IC8.16 27.5,21.76 26.68,20.95 26.68,14.04 v29.73,14.04 | v38.06,23.19 38.06,23.39 38.87,24.2 | v54.93,15.46 54.93,20.54 56.15,21.76 IC7.14 | v66.1,10.99 64.48,9.37 64.48,7.74 61.43,7.74 | v69.35,10.99 73.42,10.99 | 73.42,10.99 73.62,10.79 73.62,3.88 76.06,3.88 S1.1B S1.1A | v48.02,9.77 40.09,9.77 39.08,8.76 C7.+ | v50.46,9.77 54.32,9.77 54.32,7.34 55.33,6.32 61.43,6.32 | 61.43,7.74 S2.1A
  Bottom 0.61: v80.73,21.76 79.51,20.54 v75.04,20.54 74.64,20.75 69.56,20.75 v69.35,20.54 | v10.22,32.13 12.26,32.13 C6.1 13.68,29.89 16.12,27.45 v25.46,27.45 | v38.06,23.19 35.62,20.75 v34.2,20.75 | v29.73,14.04 35.22,8.55 38.27,8.55 C7.+ | v54.93,15.46 58.18,15.46 59.19,14.45 59.19,13.63 60.82,13.63 61.02,13.43 S2.1A | v66.1,10.99 v69.35,10.99 | v48.02,9.77 v50.46,9.77
VDISP  (via drill 0.61)
  Top 0.61: LED7.A 75.04,48.18 75.04,55.9 LED6.A 75.04,57.12 75.04,64.84 LED5.A | 85.2,67.28 85.2,72.36 LED1.A | 85.2,67.28 85.2,66.06 LED2.A 85.2,64.84 85.2,57.12 LED3.A 85.2,55.9 85.2,48.18 LED4.A | LED5.A 75.65,66.06 76.87,67.28 85.2,67.28 | LED14.A 49.64,48.18 49.64,55.9 LED13.A 49.64,57.12 49.64,64.84 LED12.A | 59.8,67.28 59.8,72.36 LED8.A 60.41,73.58 60.41,74.59 65.7,74.59 74.23,66.06 LED5.A | 59.8,67.28 59.8,66.06 LED9.A 59.8,64.84 59.8,57.12 LED10.A 59.8,55.9 59.8,48.18 LED11.A | LED12.A 50.25,66.06 51.47,67.28 59.8,67.28 | v14.29,65.04 14.29,66.26 T1.E | SJ1.1 19.37,66.87 v19.37,65.65 19.77,65.45 23.84,65.45 23.84,57.12 LED19.A | LED20.A 24.24,48.18 24.24,55.9 LED19.A | LED18.A 34.4,48.18 34.4,55.9 LED17.A 34.4,57.12 34.4,58.34 | 34.4,58.34 34.4,64.84 LED16.A 34.4,66.06 34.4,72.36 LED15.A 35.01,73.58 35.01,74.59 40.3,74.59 48.83,66.06 LED12.A | LED19.A 24.85,57.12 26.07,58.34 34.4,58.34
  Bottom 0.61: v14.29,65.04 14.9,65.65 v19.37,65.65
VSS  (via drill 0.61)
  Top 0.61: IC3.4 72.4,17.5 72.4,20.34 73.42,21.36 73.42,21.76 IC3.12 73.42,23.59 73.42,26.23 | 73.42,26.23 68.95,26.23 68.54,26.64 68.54,27.05 IC2.1 | 75.86,19.53 76.26,19.93 76.26,21.76 IC3.10 76.06,23.59 76.06,26.23 | 75.86,19.53 74.84,18.51 74.84,17.5 IC3.6 | 75.86,19.53 77.08,18.31 77.08,17.5 IC3.8 77.48,15.67 78.5,14.65 78.5,8.55 80.73,6.32 84.39,6.32 84.39,10.38 85.2,11.2 85.2,12.62 C8.- | IC1.9 91.3,23.59 91.3,27.05 IC9.8 91.5,28.87 v92.32,29.69 | 77.28,32.33 77.28,28.87 IC2.8 77.08,28.06 76.26,28.06 IC2.7 76.06,27.05 76.06,26.23 | 77.28,32.33 77.28,33.35 IC2.9 | JP2.2 95.57,32.33 77.28,32.33 | 76.06,26.23 73.42,26.23 | IC1.8 91.5,15.67 92.11,15.06 92.11,8.96 J1.3 | IC8.4 31.76,17.5 31.76,19.73 32.78,20.75 32.78,21.76 IC8.12 32.78,23.59 32.78,24.2 | 32.78,24.2 30.54,26.44 30.54,27.05 IC11.3 30.54,28.87 30.54,31.31 24.45,31.31 | IC8.8 36.44,16.68 35.62,16.68 IC8.7 35.42,17.5 35.42,21.76 IC8.10 35.62,23.59 35.62,24.4 | 36.44,25.62 36.44,25.22 35.62,24.4 | 36.44,25.62 36.44,27.05 IC11.8 | v39.28,25.62 39.28,26.03 40.3,27.05 IC5.1 | 36.44,25.62 v36.64,25.62 | 32.78,24.2 33.39,24.81 33.59,24.81 33.79,24.61 35.42,24.61 35.62,24.4 | IC10.8 64.88,27.05 65.09,26.84 65.09,18.31 64.27,17.5 IC7.7 64.07,15.67 v64.07,14.45 | IC4.7 48.83,15.67 48.83,12.62 R23.1 49.24,11.4 49.24,5.1 R24.1 49.24,3.88 v49.24,2.46 | IC5.8 49.44,28.87 49.44,33.35 IC5.9 49.24,35.17 v49.24,36.19 | 18.96,24.4 22.01,24.4 22.82,25.22 C1.2 24.24,26.84 24.24,28.06 24.45,28.27 24.45,31.31 | 18.96,24.4 18.96,27.05 IC6.8 18.96,28.87 v18.96,30.09 | G1.- 17.54,4.9 18.76,6.12 18.76,24.2 18.96,24.4 | 11.04,39.24 11.04,42.49 C3.2 11.24,44.52 11.24,47.77 IC12.1
  Top 0.61: 11.04,39.24 11.04,38.83 7.79,35.58 C2.2 | 12.87,37.61 11.24,39.24 11.04,39.24 | 12.87,37.61 14.9,35.58 14.9,35.17 IC6.12 | 18.55,43.3 20.99,45.74 20.99,51.02 21.2,51.23 21.2,51.63 21.4,51.84 C4.2 22.21,53.46 22.21,59.56 C5.2 | 18.55,43.3 12.87,37.61 | 24.45,31.31 24.45,37.41 18.55,43.3 | v81.14,16.48 82.16,16.48 IC1.1
  Bottom 0.61: v92.32,29.69 94.75,32.13 95.57,32.13 JP2.2 | C8.- 86.02,12.82 90.49,8.35 91.5,8.35 J1.3 | v36.64,25.62 v39.28,25.62 | C6.2 16.52,30.09 v18.96,30.09 19.37,30.3 27.29,38.22 47.21,38.22 v49.24,36.19
  pour Bottom (isolate 0.406): 0.27,75.97 99.73,75.97 99.73,0.33 0.27,0.33

### Text on the board
Top: ND-2006-01-BCDC | + | +
Bottom: ND-2006-01-BCDC Copyright (c) 2005-2006 Nikhil Dabas
_tplace: Lit.3V